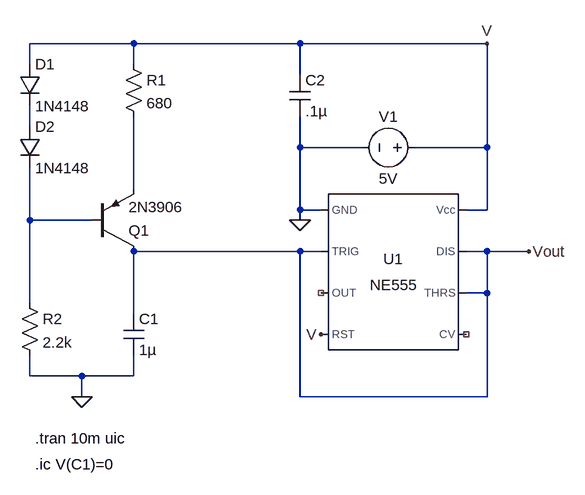
[diagram p0: schematic ramp-generator.asc]
ramp-generator.asc, the LTspice schematic file:
Version 4
SHEET 1 880 680
WIRE -160 -176 -320 -176
WIRE 96 -176 -160 -176
WIRE 384 -176 96 -176
WIRE -320 -144 -320 -176
WIRE -160 -144 -160 -176
WIRE 96 -128 96 -176
WIRE -320 -48 -320 -80
WIRE 96 -16 96 -64
WIRE 192 -16 96 -16
WIRE 384 -16 384 -176
WIRE 384 -16 272 -16
WIRE -160 48 -160 -64
WIRE 96 80 96 -16
WIRE 128 80 96 80
WIRE 384 80 384 -16
WIRE 384 80 352 80
WIRE -320 96 -320 16
WIRE -224 96 -320 96
WIRE 96 96 96 80
WIRE 96 144 -160 144
WIRE 128 144 96 144
WIRE 384 144 352 144
WIRE 448 144 384 144
WIRE 384 208 384 144
WIRE 384 208 352 208
WIRE -320 224 -320 96
WIRE -160 240 -160 144
WIRE -320 336 -320 304
WIRE -240 336 -320 336
WIRE -160 336 -160 304
WIRE -160 336 -240 336
WIRE -240 368 -240 336
WIRE 96 368 96 144
WIRE 384 368 384 208
WIRE 384 368 96 368
FLAG 96 96 0
FLAG -240 368 0
FLAG 448 144 Vout
FLAG 384 -176 V
FLAG 128 272 V
SYMBOL Misc\\NE555 240 176 R0
SYMATTR InstName U1
SYMBOL voltage 288 -16 R90
WINDOW 0 -32 56 VBottom 2
WINDOW 3 32 56 VTop 2
WINDOW 123 0 0 Left 0
WINDOW 39 0 0 Left 0
SYMATTR InstName V1
SYMATTR Value 5V
SYMBOL pnp -224 144 M180
SYMATTR InstName Q1
SYMATTR Value 2N3906
SYMBOL res -176 -160 R0
SYMATTR InstName R1
SYMATTR Value 680
SYMBOL cap -176 240 R0
SYMATTR InstName C1
SYMATTR Value 1µ
SYMBOL diode -336 -144 R0
SYMATTR InstName D1
SYMATTR Value 1N4148
SYMBOL diode -336 -48 R0
SYMATTR InstName D2
SYMATTR Value 1N4148
SYMBOL res -336 208 R0
SYMATTR InstName R2
SYMATTR Value 2.2k
SYMBOL cap 80 -128 R0
SYMATTR InstName C2
SYMATTR Value .1µ
TEXT -312 432 Left 2 !.tran 10m uic
TEXT -312 472 Left 2 !.ic V(C1)=0

The netlist it stands for:
* ramp-generator.asc
XU1 0 Vout NC_01 V NC_02 Vout Vout V NE555  ; pins GND TRIG OUT RST CV THRS DIS Vcc
V1 V 0 5V
Q1 Vout N003 N002 0 2N3906
R1 V N002 680
C1 Vout 0 1µ
D1 V N001 1N4148
D2 N001 N003 1N4148
R2 N003 0 2.2k
C2 V 0 .1µ
.model D D
.lib standard.dio
.model NPN NPN
.model PNP PNP
.lib standard.bjt
.tran 10m uic
.ic V(C1)=0
.lib NE555.sub
.backanno
.end